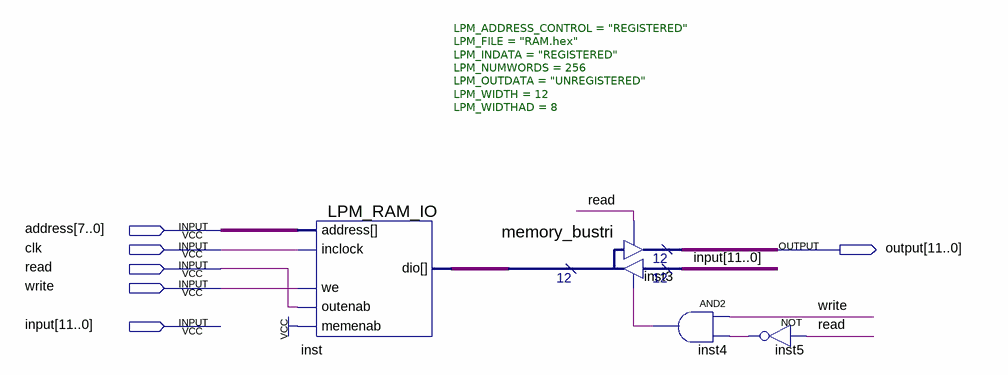
[diagram p0: schematic sheet]
// Quartus schematic Memory.bdf as structural Verilog: 4 symbols, 6 pins
module Memory (
  input  [7:0] address,
  input  clk,
  input  read,
  input  write,
  input  [11:0] \input ,
  output [11:0] \output 
);

  wire inst4_out, inst5_out;
  wire [11:0] inst_dio;

  LPM_RAM_IO #(.LPM_ADDRESS_CONTROL("REGISTERED"), .LPM_FILE("RAM.hex"), .LPM_INDATA("REGISTERED"), .LPM_NUMWORDS(256), .LPM_OUTDATA("UNREGISTERED"), .LPM_WIDTH(12), .LPM_WIDTHAD(8)) inst (
    .address(address), .memenab(1'b1), .inclock(clk), .we(write), .outenab(read), .dio(inst_dio));
  memory_bustri inst3 (.enabledt(inst4_out), .data(\input ), .enabletr(read), .result(\output ), .tridata(inst_dio));
  and inst4 (inst4_out, write, inst5_out);
  not inst5 (inst5_out, read);
endmodule
